# Altium project Gator Stream Controller.PrjPcb
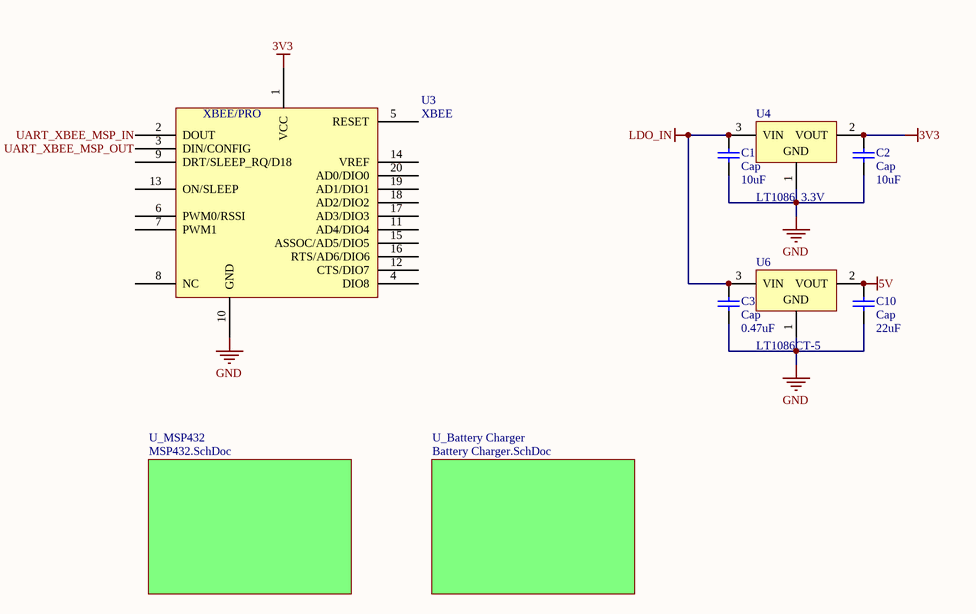
[diagram p0: Controller Top Sheet.SchDoc]
3 sheets, 41 parts. Net scope: global (net labels, ports and power ports of the same name join across sheets).
Board file: Controller.PcbDoc
Sheets:
  Controller Top Sheet.SchDoc
    U_MSP432 = MSP432.SchDoc
    U_Battery Charger = Battery Charger.SchDoc

## Sheet Controller Top Sheet.SchDoc
size A

### Parts
C1  Cap  value 10uF  [RAD-0.3]
C2  Cap  value 10uF  [RAD-0.3]
C3  Cap  value 0.47uF  [RAD-0.3]
C10  Cap  value 22uF  [RAD-0.3]
U3  XBEE  [XBEE/PRO]
U4  LT1086  3.3V  [TO-220]
U6  LT1086CT-5  [LT-T-3]

### Sub-sheets
U_Battery Charger = Battery Charger.SchDoc: no entries
U_MSP432 = MSP432.SchDoc: no entries

### Nets
3V3: C2.2 U3.1(VCC) U4.2(VOUT)
5V: C10.2 U6.2(VOUT)
GND: C1.1 C2.1 C3.1 C10.1 U3.10(GND) U4.1(GND) U6.1(GND)
LDO_IN: C1.2 C3.2 U4.3(VIN) U6.3(VIN)
UART_XBEE_MSP_IN: U3.2(DOUT)
UART_XBEE_MSP_OUT: U3.3(DIN/CONFIG)

Not connected (* = marked no-connect by the designer): U3 4(DIO8) 5(RESET) 6(PWM0/RSSI) 7(PWM1) 8(NC) 9(DRT/SLEEP_RQ/D18) 11(AD4/DIO4) 12(CTS/DIO7) 13(ON/SLEEP) 14(VREF) 15(ASSOC/AD5/DIO5) 16(RTS/AD6/DIO6) 17(AD3/DIO3) 18(AD2/DIO2) 19(AD1/DIO1) 20(AD0/DIO0)

### Notes on the sheet
- (in symbol XBEE) XBEE/PRO

### Library data of the parts
C1-C3 C10 = Cap: Capacitor; Published: 8-Jun-2000; LatestRevisionDate: 17-Jul-2002; LatestRevisionNote: Re-released for DXP Platform.; PackageReference: RAD-0.3; Publisher: Altium Limited; PackageDescription: Radial Cap, Thru-Hole; 2 Leads; 0.3 in Pin Spacing
U6 = LT1086CT-5: 1.5 A Low Dropout Positive Regulator, 2.55 to 25 V Vin, 5 V Vout, 3-pin FM (T-3), 0 to 150 degC; Manufacturer: Linear Technology; Discrete Pass Element: no; Dropout Voltage(V): 1.3; Iout(mA): 1500; Isupply(mA): 5; Number of Outputs: 1; Output Voltage: 5 V; PSRR(dB): 68; Vin Max(V): 25; Vin Min(V): 2.55; DatasheetVersion: Rev. F; PackageVersion: Jun-10; PackageReference: T-3; PackageDescription: 3-Pin Plastic TO-220, Body 10.2235 x 4.3815 mm, Pitch 2.54 mm; Supplier 1: Digi-Key; Supplier Part Number 1: LT1086CT-5-ND; Supplier 2: Newark; Supplier Part Number 2: 57M1554; RoHS: FALSE; Mounting Technology: Through Hole; PartNumber: LT1086CT-5; ComponentLink1Description: Manufacturer URL; ComponentLink1URL: http://www.linear.com/; ComponentLink2Description: Datasheet; ComponentLink2URL: http://cds.linear.com/docs/en/datasheet/1086ffs.pdf; ComponentLink3Description: Package Specification; ComponentLink3URL: http://cds.linear.com/docs/en/packaging/TO-220_3_05-08-1420.pdf

## Sheet MSP432.SchDoc
size Letter
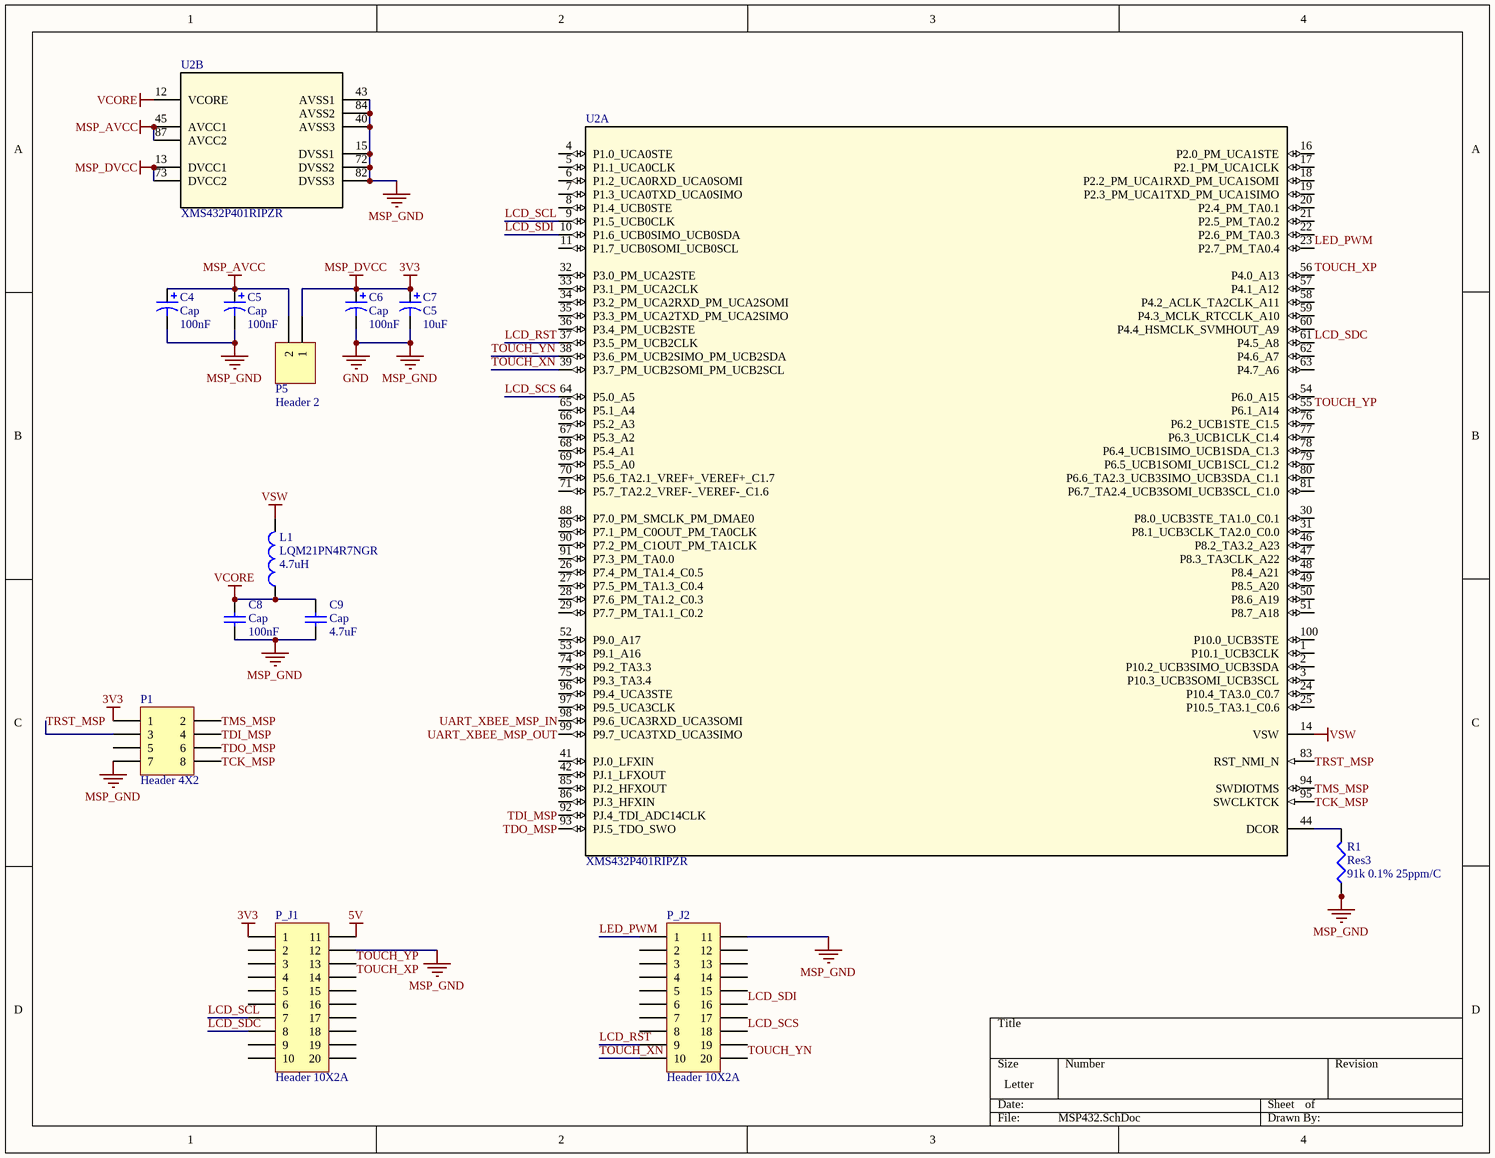
[diagram p1: MSP432.SchDoc]

### Parts
C4  Cap  value 100nF  [C0805]
C5  Cap  value 100nF  [C0805]
C6  Cap  value 100nF  [C0805]
C7  C5  value 10uF  [C0805]
C8  Cap  value 100nF  [C0805]
C9  Cap  value 4.7uF  [C0805]
L1  LQM21PN4R7NGR  value 4.7uH  [6-0805_N]
P1  Header 4X2  [HDR2X4]
P5  Header 2  [HDR1X2]
P_J1  Header 10X2A  [HDR2X10_CEN]
P_J2  Header 10X2A  [HDR2X10_CEN]
R1  Res3  value 91k 0.1% 25ppm/C  [14-1210]
U2  XMS432P401RIPZR  [PZ0100A_N]  (parts A,B of 2)

### Nets
3V3: C6.1 C7.1 P1.1 P5.1 P_J1.1 U2.13(DVCC1) U2.73(DVCC2)  [also labelled MSP_DVCC]
5V: P_J1.11
GND: C4.2 C5.2 C6.2 C7.2 C8.1 C9.2 P1.7 P_J1.12 P_J2.11 R1.1 U2.15(DVSS1) U2.40(AVSS3) U2.43(AVSS1) U2.72(DVSS2) U2.82(DVSS3) U2.84(AVSS2)  [also labelled MSP_GND]
MSP_AVCC: C4.1 C5.1 P5.2 U2.45(AVCC1) U2.87(AVCC2)
VCORE: C8.2 C9.1 L1.1 U2.12(VCORE)
VSW: L1.2 U2.14(VSW)
LCD_RST: P_J2.9 U2.37(P3.5_PM_UCB2CLK)
LCD_SCL: P_J1.7 U2.9(P1.5_UCB0CLK)
LCD_SCS: P_J2.18 U2.64(P5.0_A5)
LCD_SDC: P_J1.8 U2.61(P4.5_A8)
LCD_SDI: P_J2.16 U2.10(P1.6_UCB0SIMO_UCB0SDA)
LED_PWM: P_J2.1 U2.23(P2.7_PM_TA0.4)
TCK_MSP: P1.8 U2.95(SWCLKTCK)
TDI_MSP: P1.4 U2.92(PJ.4_TDI_ADC14CLK)
TDO_MSP: P1.6 U2.93(PJ.5_TDO_SWO)
TMS_MSP: P1.2 U2.94(SWDIOTMS)
TOUCH_XN: P_J2.10 U2.39(P3.7_PM_UCB2SOMI_PM_UCB2SCL)
TOUCH_XP: P_J1.14 U2.56(P4.0_A13)
TOUCH_YN: P_J2.20 U2.38(P3.6_PM_UCB2SIMO_PM_UCB2SDA)
TOUCH_YP: P_J1.13 U2.55(P6.1_A14)
TRST_MSP: P1.3 U2.83(RST_NMI_N)
UART_XBEE_MSP_IN: U2.98(P9.6_UCA3RXD_UCA3SOMI)
UART_XBEE_MSP_OUT: U2.99(P9.7_UCA3TXD_UCA3SIMO)
NetR1_2: R1.2 U2.44(DCOR)

Not connected (* = marked no-connect by the designer): P1 5; P_J1 2 3 4 5 6 9 10 15 16 17 18 19 20; P_J2 2 3 4 5 6 7 8 12 13 14 15 17 19; U2 1(P10.1_UCB3CLK) 2(P10.2_UCB3SIMO_UCB3SDA) 3(P10.3_UCB3SOMI_UCB3SCL) 4(P1.0_UCA0STE) 5(P1.1_UCA0CLK) 6(P1.2_UCA0RXD_UCA0SOMI) 7(P1.3_UCA0TXD_UCA0SIMO) 8(P1.4_UCB0STE) 11(P1.7_UCB0SOMI_UCB0SCL) 16(P2.0_PM_UCA1STE) 17(P2.1_PM_UCA1CLK) 18(P2.2_PM_UCA1RXD_PM_UCA1SOMI) 19(P2.3_PM_UCA1TXD_PM_UCA1SIMO) 20(P2.4_PM_TA0.1) 21(P2.5_PM_TA0.2) 22(P2.6_PM_TA0.3) 24(P10.4_TA3.0_C0.7) 25(P10.5_TA3.1_C0.6) 26(P7.4_PM_TA1.4_C0.5) 27(P7.5_PM_TA1.3_C0.4) 28(P7.6_PM_TA1.2_C0.3) 29(P7.7_PM_TA1.1_C0.2) 30(P8.0_UCB3STE_TA1.0_C0.1) 31(P8.1_UCB3CLK_TA2.0_C0.0) 32(P3.0_PM_UCA2STE) 33(P3.1_PM_UCA2CLK) 34(P3.2_PM_UCA2RXD_PM_UCA2SOMI) 35(P3.3_PM_UCA2TXD_PM_UCA2SIMO) 36(P3.4_PM_UCB2STE) 41(PJ.0_LFXIN) 42(PJ.1_LFXOUT) 46(P8.2_TA3.2_A23) 47(P8.3_TA3CLK_A22) 48(P8.4_A21) 49(P8.5_A20) 50(P8.6_A19) 51(P8.7_A18) 52(P9.0_A17) 53(P9.1_A16) 54(P6.0_A15) 57(P4.1_A12) 58(P4.2_ACLK_TA2CLK_A11) 59(P4.3_MCLK_RTCCLK_A10) 60(P4.4_HSMCLK_SVMHOUT_A9) 62(P4.6_A7) 63(P4.7_A6) 65(P5.1_A4) 66(P5.2_A3) 67(P5.3_A2) 68(P5.4_A1) 69(P5.5_A0) 70(P5.6_TA2.1_VREF+_VEREF+_C1.7) 71(P5.7_TA2.2_VREF-_VEREF-_C1.6) 74(P9.2_TA3.3) 75(P9.3_TA3.4) 76(P6.2_UCB1STE_C1.5) 77(P6.3_UCB1CLK_C1.4) 78(P6.4_UCB1SIMO_UCB1SDA_C1.3) 79(P6.5_UCB1SOMI_UCB1SCL_C1.2) 80(P6.6_TA2.3_UCB3SIMO_UCB3SDA_C1.1) 81(P6.7_TA2.4_UCB3SOMI_UCB3SCL_C1.0) 85(PJ.2_HFXOUT) 86(PJ.3_HFXIN) 88(P7.0_PM_SMCLK_PM_DMAE0) 89(P7.1_PM_C0OUT_PM_TA0CLK) 90(P7.2_PM_C1OUT_PM_TA1CLK) 91(P7.3_PM_TA0.0) 96(P9.4_UCA3STE) 97(P9.5_UCA3CLK) 100(P10.0_UCB3STE)

### Library data of the parts
C4-C7 = Cap Pol3: Polarized Capacitor (Surface Mount); Published: 8-Jun-2000; LatestRevisionDate: 29-May-2009; LatestRevisionNote: IPC-7351 Footprint Added.; PackageReference: C0805; Publisher: Altium Limited; PackageDescription: Chip Capacitor
C8 C9 = Cap Semi: Capacitor (Semiconductor SIM Model); Published: 8-Jun-2000; LatestRevisionDate: 29-May-2009; LatestRevisionNote: IPC-7351 Footprint Added.; PackageReference: C1206; Publisher: Altium Limited; PackageDescription: Chip Capacitor
L1 = Inductor: Code_IEC: 1005; Published: 8-Jun-2000; LatestRevisionDate: 29-May-2009; LatestRevisionNote: IPC-7351 Footprint Added.; PackageReference: 0402-A; Publisher: Altium Limited; PackageDescription: Chip Inductor; Code_JEITA: 0402
P1 = Header 4X2: Header, 4-Pin, Dual row; LatestRevisionDate: 17-Jul-2002; LatestRevisionNote: Re-released for DXP Platform.; Publisher: Altium Limited
P5 = Header 2: Header, 2-Pin; LatestRevisionDate: 17-Jul-2002; LatestRevisionNote: Re-released for DXP Platform.; Publisher: Altium Limited
P_J1 P_J2 = Header 10X2A: Header, 10-Pin, Dual row; LatestRevisionDate: 17-Jul-2002; LatestRevisionNote: Re-released for DXP Platform.; Publisher: Altium Limited
R1 = Res3: Resistor; Published: 8-Jun-2000; LatestRevisionDate: 29-May-2009; LatestRevisionNote: IPC-7351 Footprint Added.; PackageReference: J1-0603; Publisher: Altium Limited; PackageDescription: Chip Resistor
U2 = XMS432P401RIPZR: Imported; Manufacturer: Texas Instruments; CompType: IC; PIN_COUNT: 100; PartNumber: XMS432P401RIPZR; PackageReference: PZ0100A; MountType: SMT; RefDes: RefDes; TYPE: TYPE; Value: Value

## Sheet Battery Charger.SchDoc
size A
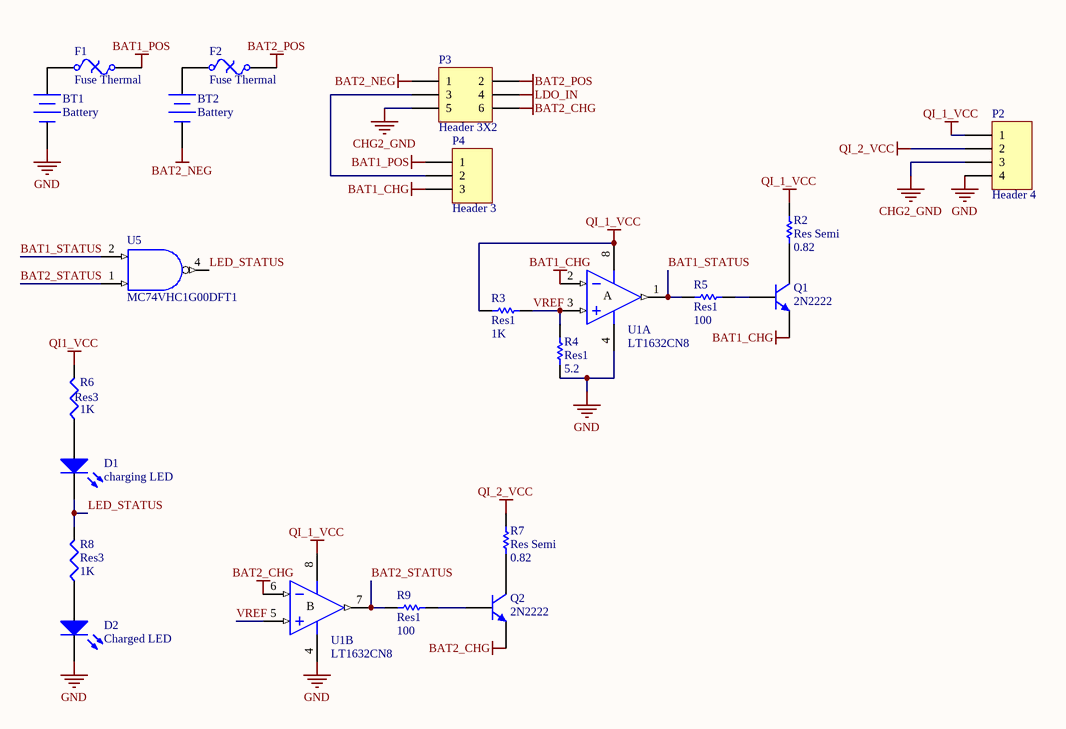
[diagram p2: Battery Charger.SchDoc]

### Parts
BT1  Battery  [BAT-2]
BT2  Battery  [BAT-2]
D1  charging LED  [LED-0]
D2  Charged LED  [LED-0]
F1  Fuse Thermal  [PIN-W2/E2.8]
F2  Fuse Thermal  [PIN-W2/E2.8]
P2  Header 4  [HDR1X4]
P3  Header 3X2  [HDR2X3]
P4  Header 3  [HDR1X3]
Q1  2N2222  [TO-92A]
Q2  2N2222  [TO-92A]
R2  Res Semi  value 0.82  [AXIAL-0.5]
R3  Res1  value 1K  [AXIAL-0.3]
R4  Res1  value 5.2  [AXIAL-0.3]
R5  Res1  value 100  [AXIAL-0.3]
R6  Res3  value 1K  [14-1210]
R7  Res Semi  value 0.82  [AXIAL-0.5]
R8  Res3  value 1K  [14-1210]
R9  Res1  value 100  [AXIAL-0.3]
U1  LT1632CN8  [DIP-8]  (parts A,B of 2)
U5  MC74VHC1G00DFT1  [419A-01_N]

### Nets
BAT1_CHG: P4.3 Q1.1(E) U1.2(IN-)
BAT1_POS: F1.1 P4.1
BAT2_CHG: P3.6 Q2.1(E) U1.6(IN-)
BAT2_NEG: BT2.2(-) P3.1
BAT2_POS: F2.1 P3.2
CHG2_GND: P2.3 P3.5
GND: BT1.2(-) D2.2(K) P2.4 R4.1 U1.4(V-) U5.3(GND)
LDO_IN: P3.4
QI1_VCC: R6.2
QI_1_VCC: P2.1 R2.2 R3.1 U1.8(V+)
QI_2_VCC: P2.2 R7.2
VDD: U5.5(VDD)
BAT1_STATUS: R5.1 U1.1(OUT) U5.2(A)
BAT2_STATUS: R9.1 U1.7(OUT) U5.1(B)
LED_STATUS: D1.2(K) R8.2 U5.4(~{Y})
VREF: R3.2 R4.2 U1.3(IN+) U1.5(IN+)
NetBT1_1: BT1.1(+) F1.2
NetBT2_1: BT2.1(+) F2.2
NetD1_1: D1.1(A) R6.1
NetD2_1: D2.1(A) R8.1
NetP3_3: P3.3 P4.2
NetQ1_2: Q1.2(B) R5.2
NetQ1_3: Q1.3(C) R2.1
NetQ2_2: Q2.2(B) R9.2
NetQ2_3: Q2.3(C) R7.1

### Notes on the sheet
- (in symbol LT1632CN8, part A) A
- (in symbol LT1632CN8, part B) B

### Library data of the parts
BT1 BT2 = Battery: Multicell Battery; Published: 24-Mar-1999; LatestRevisionDate: 17-Jul-2002; LatestRevisionNote: Re-released for DXP Platform.; PackageReference: BAT-2; Publisher: Altium Limited; PackageDescription: Battery; 2 Leads
D1 D2 = LED0: Typical INFRARED GaAs LED; Published: 8-Jun-2000; LatestRevisionDate: 08-Jul-2005; LatestRevisionNote: Mech Layer 1 removed.; PackageReference: LED-0; Publisher: Altium Limited; PackageDescription: LED; 2 Leads
F1 F2 = Fuse Thermal: Thermal Fuse; Published: 24-Mar-1999; LatestRevisionDate: 17-Jul-2002; LatestRevisionNote: Re-released for DXP Platform.; PackageReference: PIN-W2/E2.8; Publisher: Altium Limited; PackageDescription: Thru-Hole; 2 Leads
P2 = Header 4: Header, 4-Pin; LatestRevisionDate: 17-Jul-2002; LatestRevisionNote: Re-released for DXP Platform.; Publisher: Altium Limited
P3 = Header 3X2: Header, 3-Pin, Dual row; LatestRevisionDate: 17-Jul-2002; LatestRevisionNote: Re-released for DXP Platform.; Publisher: Altium Limited
P4 = Header 3: Header, 3-Pin; LatestRevisionDate: 17-Jul-2002; LatestRevisionNote: Re-released for DXP Platform.; Publisher: Altium Limited
Q1 Q2 = 2N3904: NPN General Purpose Amplifier; Published: 8-Jun-2000; LatestRevisionDate: 15-Jan-2003; LatestRevisionNote: PCB Footprint 'BCY-W3/D4.7' replaced; DatasheetVersion: 1997; PackageVersion: Sep-1998; PackageReference: TO-92A; Publisher: Altium Limited; PackageDescription: TO, Flat Index; 3 In-Line, Axial Leads; Body Dia. 4.5mm; Leads 0.51 x 0.48 mm (max); ComponentLink1Description: Manufacturer Link; ComponentLink1URL: http://www.fairchildsemi.com/; ComponentLink2Description: Datasheet; ComponentLink2URL: http://www.fairchildsemi.com/ds/2N%2F2N3904.pdf
R2 R7 = Res Semi: Semiconductor Resistor; Published: 8-Jun-2000; LatestRevisionDate: 17-Jul-2002; LatestRevisionNote: Re-released for DXP Platform.; PackageReference: AXIAL-0.5; Publisher: Altium Limited; PackageDescription: Axial Device, Thru-Hole; 2 Leads; 0.5 in Pin Spacing
R3-R5 R9 = Res1: Resistor; Published: 8-Jun-2000; LatestRevisionDate: 17-Jul-2002; LatestRevisionNote: Re-released for DXP Platform.; PackageReference: AXIAL-0.3; Publisher: Altium Limited; PackageDescription: Axial Device, Thru-Hole; 2 Leads; 0.3 in Pin Spacing
R6 R8 = Res3: Resistor; Published: 8-Jun-2000; LatestRevisionDate: 29-May-2009; LatestRevisionNote: IPC-7351 Footprint Added.; PackageReference: J1-0603; Publisher: Altium Limited; PackageDescription: Chip Resistor
U1 = LT1632CN8: 45MHz, 45V/µs, Dual Rail-to-Rail Input and Output Precision Operational Amplifier; Note: 1455; Published: 8-Jun-2000; LatestRevisionDate: 29-May-2009; LatestRevisionNote: Component Body Added.; DatasheetVersion: 1996; PackageVersion: N8 1002; PackageReference: N8; Publisher: Altium Limited; PackageDescription: DIP, Plastic, 8-Pin, Row Spacing 7.62 mm, Pitch 2.54 mm; ComponentLink1Description: Manufacturer Link; ComponentLink1URL: http://www.linear.com/; ComponentLink2Description: Datasheet; ComponentLink2URL: http://www.linear.com/pc/downloadDocument.do?navId=H0,C1,C1154,C1009,C1022,P1642,D3055
U5 = MC74VHC1G00DFT1: 2-Input NAND Gate; Published: 15-Apr-2002; LatestRevisionDate: 12-Dec-2006; LatestRevisionNote: IPC-7351 Footprint Added.; DatasheetVersion: Dec-1999; PackageVersion: Oct-1999; PackageReference: 419A-01; Publisher: Altium Limited; PackageDescription: 5-Pin SOT-353 Package 0.65 mm Pitch, 2.1 mm Lead Span; ComponentLink1Description: Manufacturer Link; ComponentLink1URL: http://www.onsemi.com/; ComponentLink2Description: Datasheet; ComponentLink2URL: http://www.onsemi.com/pub/Collateral/MC74VHC1G00-D.PDF

## Nets that join several sheets
3V3: Controller Top Sheet (C2.2 U3.1 U4.2), MSP432 (7 pins)
5V: Controller Top Sheet (C10.2 U6.2), MSP432 (P_J1.11)
GND: Controller Top Sheet (7 pins), MSP432 (16 pins), Battery Charger (6 pins)
LDO_IN: Controller Top Sheet (C1.2 C3.2 U4.3 U6.3), Battery Charger (P3.4)
UART_XBEE_MSP_IN: Controller Top Sheet (U3.2), MSP432 (U2.98)
UART_XBEE_MSP_OUT: Controller Top Sheet (U3.3), MSP432 (U2.99)